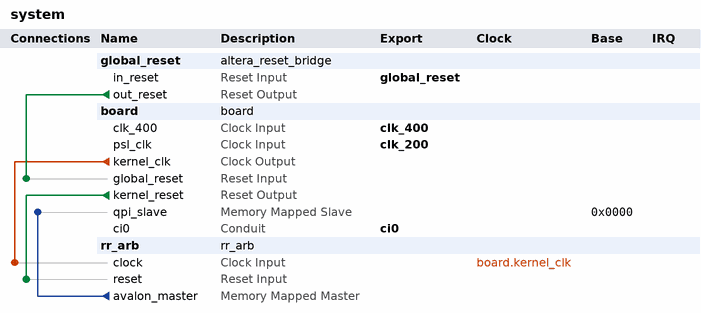
[diagram p0: system contents]
# Platform Designer (Qsys) system system, Arria 10 10AX115U3F45E2SGE3
# Parameters at their usual value, and those the tool derives, are not listed.
package require -exact qsys 15.1
create_system system
set_project_property DEVICE_FAMILY {Arria 10}
set_project_property DEVICE 10AX115U3F45E2SGE3

add_instance global_reset altera_reset_bridge 15.1
set_instance_parameter_value global_reset ACTIVE_LOW_RESET 1
set_instance_parameter_value global_reset SYNCHRONOUS_EDGES none

add_instance board board 1.0

add_instance rr_arb rr_arb 1.0

# connections
add_connection board.kernel_clk rr_arb.clock clock
add_connection board.kernel_reset rr_arb.reset reset
add_connection global_reset.out_reset board.global_reset reset
add_connection rr_arb.avalon_master board.qpi_slave avalon
set_connection_parameter_value rr_arb.avalon_master/board.qpi_slave baseAddress 0x0000

# exported interfaces
add_interface ci0 conduit end
set_interface_property ci0 EXPORT_OF board.ci0
add_interface clk_200 clock sink
set_interface_property clk_200 EXPORT_OF board.psl_clk
add_interface clk_400 clock sink
set_interface_property clk_400 EXPORT_OF board.clk_400
add_interface global_reset reset sink
set_interface_property global_reset EXPORT_OF global_reset.in_reset

set_interconnect_requirement {$system} qsys_mm.clockCrossingAdapter FIFO
set_interconnect_requirement {$system} qsys_mm.maxAdditionalLatency 0

save_system system.qsys
